# Altium project Sumo_2016.PrjPcb (part 1 of 2)
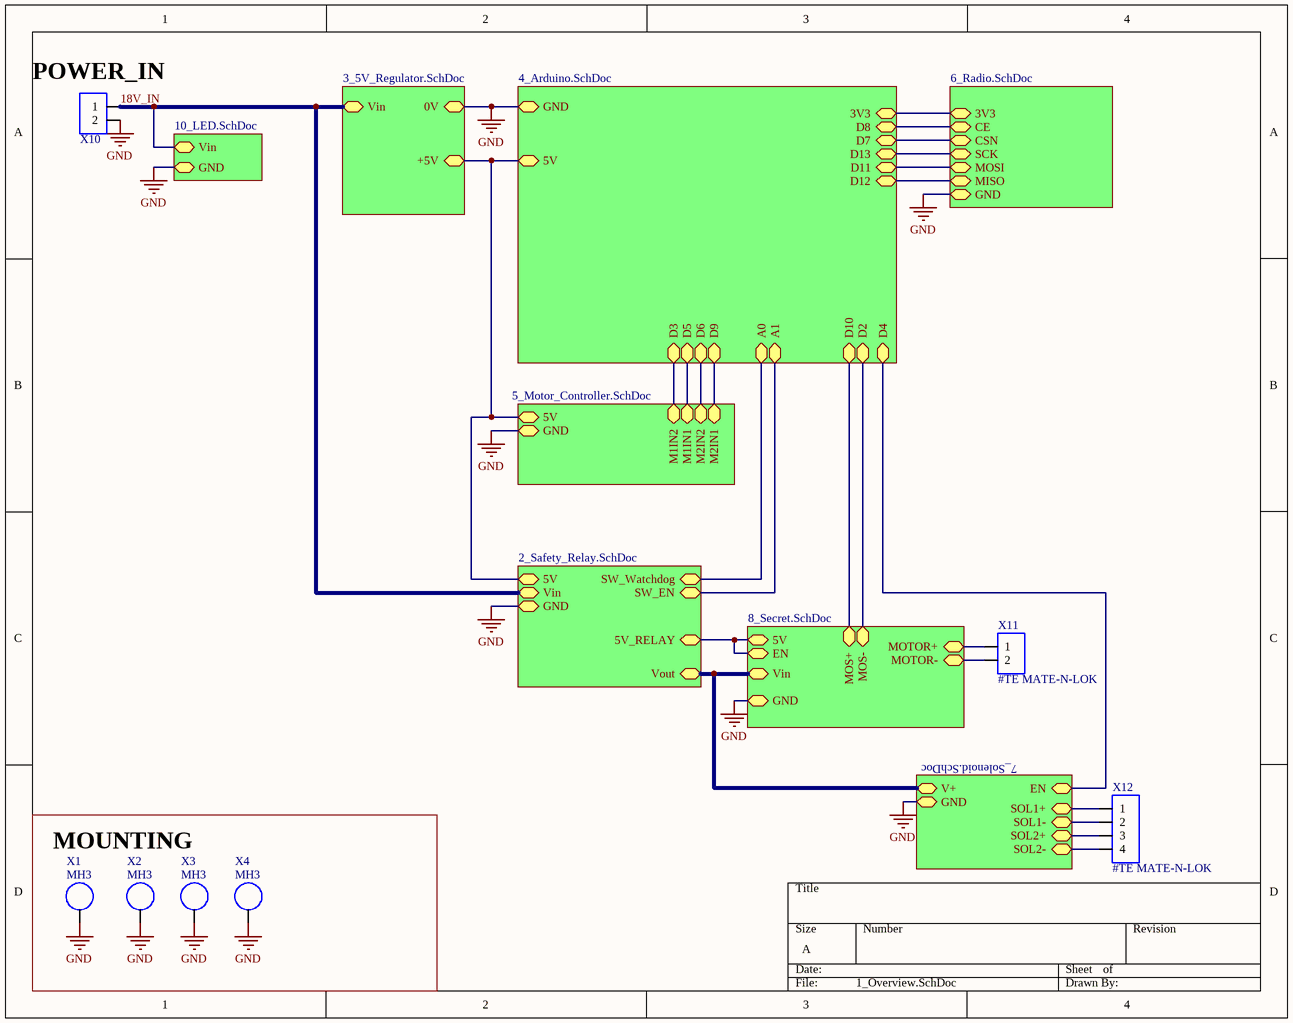
[diagram p0: 1_Overview.SchDoc]
10 sheets, 85 parts. Net scope: strictly hierarchical (ports join the sheet entries above them; power ports are local).
Board file: PCB1.PcbDoc
Sheets:
  1_Overview.SchDoc
     = 3_5V_Regulator.SchDoc
     = 4_Arduino.SchDoc
     = 6_Radio.SchDoc
     = 5_Motor_Controller.SchDoc
     = 2_Safety_Relay.SchDoc
      5 = 10_LED.SchDoc
      1 = 10_LED.SchDoc
      2 = 10_LED.SchDoc
      3 = 10_LED.SchDoc
      4 = 10_LED.SchDoc
       = 11_Watchdog.SchDoc
     = 7_Solenoid.SchDoc
     = 8_Secret.SchDoc
     = 10_LED.SchDoc

## Sheet 1_Overview.SchDoc
size A

### Parts
X1  MH3  [MH-M3-SEMS-6.7-3.6-Vias-Unplated]  (no BOM)
X2  MH3  [MH-M3-SEMS-6.7-3.6-Vias-Unplated]  (no BOM)
X3  MH3  [MH-M3-SEMS-6.7-3.6-Vias-Unplated]  (no BOM)
X4  MH3  [MH-M3-SEMS-6.7-3.6-Vias-Unplated]  (no BOM)
X10  CONN2_12AWG_Hole  [2_Wire_12AWG]  (value not drawn)  (no BOM)
X11  #TE MATE-N-LOK  [HDR-6.35-2-MATENLOK]  (no BOM)
X12  #TE MATE-N-LOK  [HDR-3.0-4X1-MICROMATENLOK-VERT]  (no BOM)

### Blocks framed on the sheet
MOUNTING: X1-X4

### Sub-sheets
? = 3_5V_Regulator.SchDoc: Vin, 0V, +5V
? = 4_Arduino.SchDoc: 5V, GND, D3, D5, D6, D9, 3V3, D8, D7, D13, D11, D12, D10, D4, A0, A1, D2
? = 6_Radio.SchDoc: GND, 3V3, CE, CSN, SCK, MOSI, MISO
? = 5_Motor_Controller.SchDoc: M1IN1, M1IN2, M2IN1, M2IN2, 5V, GND
? = 2_Safety_Relay.SchDoc: Vin, GND, Vout, SW_Watchdog, SW_EN, 5V_RELAY, 5V
? = 7_Solenoid.SchDoc: EN, V+, GND, SOL1+, SOL1-, SOL2+, SOL2-
? = 8_Secret.SchDoc: MOTOR-, EN, Vin, GND, 5V, MOTOR+, MOS+, MOS-
? = 10_LED.SchDoc: GND, Vin

### Nets
5V: sheet /+5V, sheet /5V, sheet /5V, sheet /5V
18V_IN: X10.1 ; sheet /Vin, sheet /Vin, sheet /Vin
EN: sheet /5V_RELAY, sheet /EN, sheet /5V
GND: X1.1 X2.1 X3.1 X4.1 X10.2 ; sheet /0V, sheet /GND, sheet /GND, sheet /GND, sheet /GND, sheet /GND, sheet /GND, sheet /GND
V+: sheet /Vout, sheet /V+, sheet /Vin
EN: sheet /D4, sheet /EN  [a separate net that carries the same name]
MOS+: sheet /D10, sheet /MOS+
MOS-: sheet /D2, sheet /MOS-
NetC82_2: X11.1 ; sheet /MOTOR+
NetC83_2: X11.2 ; sheet /MOTOR-
NetH60_2: sheet /3V3, sheet /3V3
NetH60_3: sheet /D8, sheet /CE
NetH60_4: sheet /D7, sheet /CSN
NetH60_5: sheet /D13, sheet /SCK
NetH60_6: sheet /D11, sheet /MOSI
NetH60_7: sheet /D12, sheet /MISO
NetR72_2: X12.2 ; sheet /SOL1-
NetR76_2: X12.4 ; sheet /SOL2-
NetV21_z: sheet /A1, sheet /SW_EN
NetV71_x: X12.1 ; sheet /SOL1+
NetV74_x: X12.3 ; sheet /SOL2+
NetV200_4: sheet /A0, sheet /SW_Watchdog
NetX42_4: sheet /D9, sheet /M2IN1
NetX42_7: sheet /D6, sheet /M2IN2
NetX42_8: sheet /D5, sheet /M1IN1
NetX42_10: sheet /D3, sheet /M1IN2

### Notes on the sheet
- (near X10) POWER_IN

### Library data of the parts
X1-X4 = 7545: MOUNTING HOLE; Part Field 1: MH3 Loose Unplated with Vias; IPN: 7545; Lead_Process_Compatible: Yes; SubmittedBy: zad; DeviceRank: 2; Part Field 2: - -; ComponentLink1Description: -; ComponentLink2Description: Compliant; ComponentLink1URL: -; ComponentLink2URL: -; Altium_Comment_Old: MH3 Loose Unplated with Vias; Altium_Comment: MH3; Symbol: MOUNTING-HOLE; Manufacturer: -; PartNumber: -; LastChanged: 24/06/14 18:13:23; IPN_Search: 7545; OrderNumber: -; PartType: PCB; CheckedBy: vhq
X10 = -: Symbol: CONN2; Lead_Process_Compatible: Yes; SubmittedBy: ZMZE; DeviceRank: 2; IPN: -; Part Field 1: CONN2_12AWG_Hole; Part Field 2: -; Altium_Comment_Old: CONN2_12AWG_Hole; Altium_Comment: CONN2_12AWG_Hole; Manufacturer: -; PartNumber: -; LastChanged: 27/09/12 10:20:42; Supplier1: -; Supplier1_PartNumber: -; Supplier2: -; Supplier2_PartNumber: -; IPN_Search: -; Characteristics: -; OrderNumber: -; PartType: PCB; Price: -; CheckedBy: -; Price_100: -; Price_1000: -; Price_5000: -
X11 = 5732: Connector 2 pin general; Part Field 1: CONN2 2x1 6.35mm MATE-N-LOK Pin Header Shrouded Vert RoHS; Manufacturer: TYCO; PartNumber: 350786-1; IPN: 5732; EndOfLife: Active EOL:May 2023; Characteristics: TIN Imax10AWG = 19A Vmax = 600V -55..+105; Lead_Process_Compatible: Yes; SubmittedBy: BWJ; DeviceRank: 2; Part Field 2: TYCO 350786-1; ComponentLink1Description: ENG_CD_350786_R2.pdf; ComponentLink2Description: Tyco_350786_MD.pdf; ComponentLink1URL: http://ecad.vsl.com.au/apps/BomGen/Data/rel/datasheets/new_parts/ENG_CD_350786_R2.pdf; ComponentLink2URL: http://ecad.vsl.com.au/apps/BomGen/Data/rel/rohs_compliance/new_certificates/Tyco_350786_MD.pdf; Altium_Comment_Old: CONN2 2x1 6.35mm MATE-N-LOK Pin Header Shrouded Vert RoHS; Altium_Comment: #TE MATE-N-LOK; Symbol: CONN2; LastChanged: 24/02/12 18:41:43; Supplier1: Farnell; Supplier1_PartNumber: 750232; Supplier2: Digikey; Supplier2_PartNumber: A14314-ND; IPN_Search: 5732; OrderNumber: 350786-1; PartType: PCB; Price: 0.76; CheckedBy: LGG; Price_100: M$0.502; Price_1000: M$0.327; Price_5000: M$0.327
X12 = 5975: Connector 4 pin general; Part Field 1: CONN4 4X1 3mm Micro MATE-N-LOK VERT; Manufacturer: TE Connectivity; PartNumber: 2-1445094-4; IPN: 5975; EndOfLife: Active EOL:Jul 2022; Characteristics: Ur=250Vac Imax=5A UL 94V-0 260C 0.30um gold; Lead_Process_Compatible: Yes; SubmittedBy: SAA; DeviceRank: 2; Part Field 2: TE Connectivity 2-1445094-4; ComponentLink1Description: TE Connectivity_2-1445094-4_ENG_CD_1445094_A2.pdf; ComponentLink2Description: TE Connectivity_2-1445094-4_RoHS_Compliance_130325_204622.pdf; ComponentLink1URL: http://ecad.vsl.com.au/apps/BomGen/Data/rel/datasheets/TE Connectivity/TE Connectivity_2-1445094-4_ENG_CD_1445094_A2.pdf; ComponentLink2URL: http://ecad.vsl.com.au/apps/BomGen/Data/rel/rohs_compliance/new_certificates/TE Connectivity_2-1445094-4_RoHS_Compliance_130325_204622.pdf; Altium_Comment_Old: CONN4 4X1 3mm Micro MATE-N-LOK VERT; Altium_Comment: #TE MATE-N-LOK; Symbol: CONN4; LastChanged: 06/05/14 13:09:13; Supplier1: mouser; Supplier1_PartNumber: 2-1445094-4; IPN_Search: 5975; OrderNumber: 2-1445094-4; PartType: PCB; Price: 1.06; CheckedBy: vhq; Price_100: M$0.786; Price_1000: M$0.700; Price_5000: M$0.633

## Sheet 3_5V_Regulator.SchDoc
size A
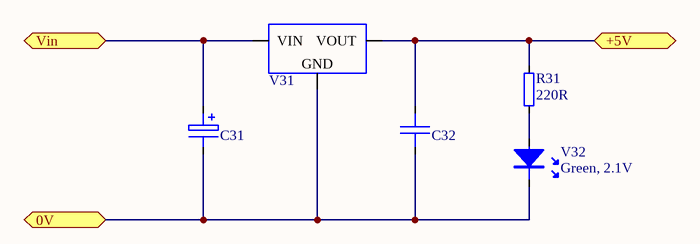
[diagram p1: 3_5V_Regulator.SchDoc]

### Parts
C31  CAP ELEC 100u 63V 20% Radial RoHS  [RBP-3.5-0.8-8.0]  (value not drawn)
C32  10u 50V  [1210]  (value not drawn)
R31  220R  [1206]
V31  LM78L05ACZ  [TO92_W]  (value not drawn)
V32  Green, 2.1V  [LED-0805]

### Ports
0V, +5V, Vin

### Nets
5V: C32.1 R31.1 V31.x(VOUT) ; port +5V
18V_IN: C31.+ V31.z(VIN) ; port Vin
GND: C31.- C32.2 V31.y(GND) V32.k ; port 0V
NetR31_2: R31.2 V32.a

### Library data of the parts
C31 = 5900: Capacitor Polarised; Manufacturer: Panasonic; PartNumber: ECA1JM101; IPN: 5900; EndOfLife: Active EOL:Jul 2022; Characteristics: Ir=270mA tan=0.11 D=8 H=11.5 2000h; Lead_Process_Compatible: Yes; SubmittedBy: GXA; DeviceRank: 2; Part Field 1: CAP ELEC 100u 63V 20% Radial RoHS; Part Field 2: Panasonic ECA1JM101; ComponentLink1Description: Panasonic_ECA-1JM101_DS.pdf; ComponentLink2Description: Panasonic_ECA-1JM101_RCC.pdf; ComponentLink1URL: http://ecad.vsl.com.au/apps/BomGen/Data/rel/datasheets/new_parts/Panasonic_ECA-1JM101_DS.pdf; ComponentLink2URL: http://ecad.vsl.com.au/apps/BomGen/Data/rel/rohs_compliance/new_certificates/Panasonic_ECA-1JM101_RCC.pdf; Altium_Comment_Old: CAP ELEC 100u 63V 20% Radial RoHS; Altium_Comment: CAP ELEC 100u 63V 20% Radial RoHS; Symbol: CAP-POL; LastChanged: 9/11/12 09:27:10; Supplier1: Arrow; Supplier1_PartNumber: ECA1JM101; Supplier2: Digikey; Supplier2_PartNumber: P5193-ND; IPN_Search: 5900; OrderNumber: ECA1JM101; PartType: PCB; Price: US $0.1644; CheckedBy: VHQ; Price_100: M$0.123; Price_1000: M$0.104; Price_5000: M$0.093
C32 = 6024: Capacitor; Part Field 1: CAP CER 10u 10% 50V X7S 1210; Manufacturer: TDK; PartNumber: C3225X7S1H106K250AB; IPN: 6024; EndOfLife: Active EOL:Sep 2023; Characteristics: -55...125C; Lead_Process_Compatible: Yes; SubmittedBy: AFF; DeviceRank: 2; Part Field 2: TDK C3225X7S1H106K250AB; ComponentLink1Description: mlcc_commercial_general_en.pdf; ComponentLink2Description: TDK_C_Series_Capacitors_RoHS_CoC.pdf; ComponentLink1URL: http://ecad.vsl.com.au/apps/BomGen/Data/rel/datasheets/new_parts/mlcc_commercial_general_en.pdf; ComponentLink2URL: \\michelangelo\erg shared folder\ECAD\elecCAD\apps\BomGen\Data\rel\rohs_compliance\new_certificates\TDK_C_Series_Capacitors_RoHS_CoC.pdf; Altium_Comment_Old: CAP CER 10u 10% 50V X7S 1210; Altium_Comment: 10u 50V; Symbol: CAP; LastChanged: 26/02/14 13:10:58; Supplier1: Digikey; Supplier1_PartNumber: 445-4536-2-ND; IPN_Search: 6024; OrderNumber: C3225X7S1H106K250AB; PartType: PCB; Price: $0.31; CheckedBy: TTX; Price_100: M$0.495; Price_1000: M$0.339; Price_5000: M$0.292
R31 = 3827: Resistor; Part Field 1: RES 220R 1% 250mW 1206 RoHS; Manufacturer: Phycomp; PartNumber: RC1206FR-07220RL; IPN: 3827; EndOfLife: Active EOL:Jan 2023; Characteristics: 100ppm/C -55..+155C U=150Vrms Reel=5000pcs; OrderNumber: 232272462201L; Lead_Process_Compatible: Yes; SubmittedBy: ART; DeviceRank: 2; Part Field 2: Phycomp RC1206FR-07220RL; ComponentLink1Description: Phycomp_RC1206series_DS.pdf; ComponentLink2Description: Phycomp_Generic_RCS.pdf; ComponentLink1URL: http://ecad.vsl.com.au/apps/BomGen/Data/rel/datasheets/new_parts/Phycomp_RC1206series_DS.pdf; ComponentLink2URL: http://ecad.vsl.com.au/apps/BomGen/Data/rel/rohs_compliance/new_certificates/Phycomp_Generic_RCS.pdf; Altium_Comment_Old: RES 220R 1% 250mW 1206 RoHS; Altium_Comment: 220R; Symbol: RES; Supplier1: Arrow; Supplier1_PartNumber: RC1206FR-07220RL; Supplier2: Xon; IPN_Search: 3827; PartType: PCB; CheckedBy: ART; Price_5000: M$0.004
V31 = 7713: IC LM78LXX 3-terminal regulator TO92; Part Field 1: IC REG 78L05 +5V 100mA; Manufacturer: TI; PartNumber: LM78L05ACZ/NOPB; IPN: 7713; EndOfLife: Active EOL:Mar 2026; Characteristics: 0..+125C; Lead_Process_Compatible: Yes; SubmittedBy: vhq; DeviceRank: 2; Part Field 2: TI LM78L05ACZ/NOPB; ComponentLink1Description: TI_LM78L05ACZ_NOPB_TI_LM78Lxx.pdf; ComponentLink2Description: TI_LM78L05ACZ_NOPB_TI_LM78Lxx_RoHS.pdf; ComponentLink1URL: http://ecad.vsl.com.au/apps/BomGen/Data/rel/datasheets/TI/TI_LM78L05ACZ_NOPB_TI_LM78Lxx.pdf; ComponentLink2URL: http://ecad.vsl.com.au/apps/BomGen/Data/rel/rohs_compliance/new_certificates/TI_LM78L05ACZ_NOPB_TI_LM78Lxx_RoHS.pdf; Altium_Comment_Old: IC REG 78L05 +5V 100mA; Altium_Comment: LM78L05ACZ; Symbol: LM78LXX-TO92; LastChanged: 24/06/14 09:31:18; Supplier1: Digikey; Supplier1_PartNumber: LM78L05ACZNS/NOPB-ND; IPN_Search: 7713; OrderNumber: LM78L05ACZ/NOPB; PartType: PCB; CheckedBy: pfu
V32 = 6313: LED; Part Field 1: LED GREEN 0805 ROHS; Manufacturer: Chicago Miniature Lighting; PartNumber: CMD17-21UGC/TR8; IPN: 6313; EndOfLife: Active EOL:Sep 2021; Characteristics: GREEN Intensity=15mcd Ta=-40..+85C; Lead_Process_Compatible: Yes; SubmittedBy: ZJXL; DeviceRank: 2; Part Field 2: Chicago Miniature Lighting CMD17-21UGC/TR8; ComponentLink1Description: 1-25.pdf; ComponentLink2Description: CMD17-21UGC_TR8 RoHS CoC.pdf; ComponentLink1URL: \\michelangelo\erg shared folder\ECAD\elecCAD\apps\BomGen\Data\rel\datasheets\new_parts\1-25.pdf; ComponentLink2URL: \\michelangelo\erg shared folder\ECAD\elecCAD\apps\BomGen\Data\rel\rohs_compliance\new_certificates\CMD17-21UGC_TR8 RoHS CoC.pdf; Altium_Comment_Old: LED GREEN 0805 ROHS; Altium_Comment: LED Green; Symbol: LED; LastChanged: 6/09/13 17:30:23; Supplier1: Mouser; Supplier1_PartNumber: 606-CMD17-21UGC; Supplier2: DIGIKEY; Supplier2_PartNumber: L62415CT-ND; IPN_Search: 6313; OrderNumber: CMD17-21UGC/TR8; PartType: PCB; Price: 0.279 USD; CheckedBy: SAA; Price_100: M$0.170; Price_1000: M$0.150; Price_5000: M$0.150

## Sheet 4_Arduino.SchDoc
size A
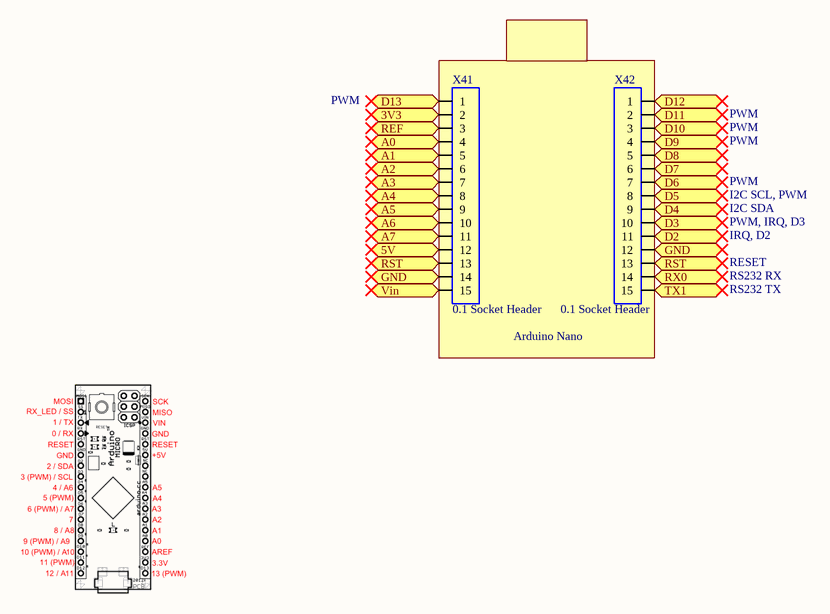
[diagram p2: 4_Arduino.SchDoc]

### Parts
X41  0.1 Socket Header  [HDR-0.1-15X1]
X42  0.1 Socket Header  [HDR-0.1-15X1]

### Blocks framed on the sheet
Arduino Nano: X41 X42

### Ports
3V3, 5V, A0, A1, A2, A3, A4, A5, A6, A7, D2, D3, D4, D5, D6, D7, D8, D9, D10, D11, D12, D13, GND, REF, RST, RX0, TX1, Vin

### Nets
5V: X41.12 ; port 5V
GND: X41.14 X42.12 ; port GND
EN: X42.9 ; port D4
MOS+: X42.3 ; port D10
MOS-: X42.11 ; port D2
NetH60_2: X41.2 ; port 3V3
NetH60_3: X42.5 ; port D8
NetH60_4: X42.6 ; port D7
NetH60_5: X41.1 ; port D13
NetH60_6: X42.2 ; port D11
NetH60_7: X42.1 ; port D12
NetV21_z: X41.5 ; port A1
NetV200_4: X41.4 ; port A0
NetX41_3: X41.3 ; port REF
NetX41_6: X41.6 ; port A2
NetX41_7: X41.7 ; port A3
NetX41_8: X41.8 ; port A4
NetX41_9: X41.9 ; port A5
NetX41_10: X41.10 ; port A6
NetX41_11: X41.11 ; port A7
NetX41_13: X41.13 X42.13 ; port RST
NetX41_15: X41.15 ; port Vin
NetX42_4: X42.4 ; port D9
NetX42_7: X42.7 ; port D6
NetX42_8: X42.8 ; port D5
NetX42_10: X42.10 ; port D3
NetX42_14: X42.14 ; port RX0
NetX42_15: X42.15 ; port TX1

### Notes on the sheet
- PWM
- I2C SCL, PWM
- RS232 RX
- RESET
- IRQ, D2
- PWM, IRQ, D3
- I2C SDA
- RS232 TX

### Library data of the parts
X41 X42 = 9896: Connector 15 pin general; Part Field 1: CONN15 15X1 2.54mm Socket Header, Tin, RoHS; Manufacturer: Sullins; PartNumber: PPTC151LFBN-RC; IPN: 9896; Characteristics: I=3A -40..105C 250V; Lead_Process_Compatible: Yes; SubmittedBy: zmze; DeviceRank: 2; Part Field 2: Sullins PPTC151LFBN-RC; ComponentLink1Description: Sullins_PPTC151LFBN-RC_78_P(N)PxCxxxLFBN-RC,_10492-H.pdf; ComponentLink2Description: Compliant; ComponentLink1URL: http://ecad.vsl.com.au/apps/BomGen/Data/rel/datasheets/Sullins/Sullins_PPTC151LFBN-RC_78_P(N)PxCxxxLFBN-RC,_10492-H.pdf; Altium_Comment_Old: CONN15 15X1 2.54mm Socket Header, Tin, RoHS; Altium_Comment: 0.1 Socket Header; Symbol: CONN15; LastChanged: 09/08/16 08:13:32; Supplier1: Digikey; Supplier1_PartNumber: S7013-ND; IPN_Search: 9896; OrderNumber: PPTC151LFBN-RC; PartType: PCB

## Sheet 6_Radio.SchDoc
size A
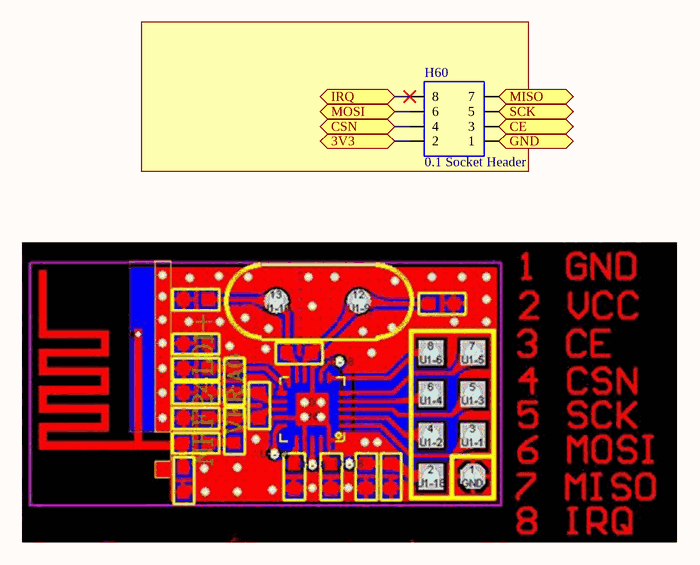
[diagram p3: 6_Radio.SchDoc]

### Parts
H60  0.1 Socket Header  [HDR-0.1-4x2]

### Ports
3V3, CE, CSN, GND, IRQ, MISO, MOSI, SCK

### Nets
GND: H60.1 ; port GND
NetH60_2: H60.2 ; port 3V3
NetH60_3: H60.3 ; port CE
NetH60_4: H60.4 ; port CSN
NetH60_5: H60.5 ; port SCK
NetH60_6: H60.6 ; port MOSI
NetH60_7: H60.7 ; port MISO
NetH60_8: H60.8 ; port IRQ

### Library data of the parts
H60 = 9897: Connector 4x2 way; Part Field 1: CONN8 15X1 2.54mm Socket Header, Gold, RoHS; Manufacturer: Sullins; PartNumber: PPPC042LFBN-RC; IPN: 9897; Characteristics: I=3A -40..105C 250V; Lead_Process_Compatible: Yes; SubmittedBy: zmze; DeviceRank: 2; Part Field 2: Sullins PPPC042LFBN-RC; ComponentLink1Description: Sullins_PPPC042LFBN-RC_Sullins_PPTC151LFBN-RC_78_P(N)PxCxxxLFBN-RC,_10492-H.pdf; ComponentLink2Description: Compliant; ComponentLink1URL: http://ecad.vsl.com.au/apps/BomGen/Data/rel/datasheets/Sullins/Sullins_PPPC042LFBN-RC_Sullins_PPTC151LFBN-RC_78_P(N)PxCxxxLFBN-RC,_10492-H.pdf; Altium_Comment_Old: CONN8 15X1 2.54mm Socket Header, Gold, RoHS; Altium_Comment: 0.1 Socket Header; Symbol: CONN8-4X2; LastChanged: 09/08/16 09:50:21; Supplier1: Digikey; Supplier1_PartNumber: S7107-ND; IPN_Search: 9897; OrderNumber: PPPC042LFBN-RC; PartType: PCB

## Sheet 5_Motor_Controller.SchDoc
size A
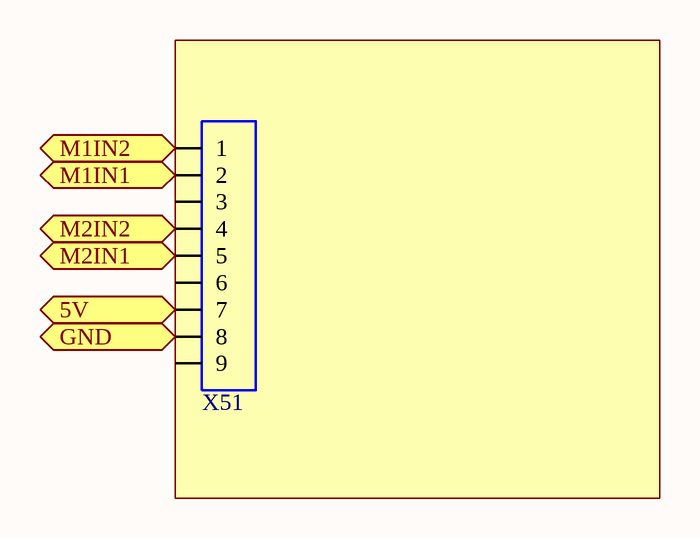
[diagram p4: 5_Motor_Controller.SchDoc]

### Parts
X51  TE 87220-9  [HDR-0.1-9]  (value not drawn)

### Ports
5V, GND, M1IN1, M1IN2, M2IN1, M2IN2

### Nets
5V: X51.7 ; port 5V
GND: X51.8 ; port GND
NetX42_4: X51.5 ; port M2IN1
NetX42_7: X51.4 ; port M2IN2
NetX42_8: X51.2 ; port M1IN1
NetX42_10: X51.1 ; port M1IN2

Not connected (* = marked no-connect by the designer): X51 3 6 9

### Library data of the parts
X51 = 7236: Connector 9 pin general; Part Field 1: CONN9 9X1 2.54mm VERT PIN HEADER; Manufacturer: TE Connectivity; IPN: 7236; EndOfLife: Active EOL:Jul 2022; Characteristics: 0.78um GOLD; Lead_Process_Compatible: Yes; SubmittedBy: ZAD; DeviceRank: 2; Part Field 2: TE Connectivity 87220-9; ComponentLink1Description: TE_87220_Series_DS.pdf; ComponentLink2Description: TE_87220-9_RoHS.pdf; ComponentLink1URL: \\michelangelo\erg shared folder\ECAD\elecCAD\apps\BomGen\Data\rel\datasheets\new_parts\TE_87220_Series_DS.pdf; ComponentLink2URL: \\michelangelo\erg shared folder\ECAD\elecCAD\apps\BomGen\Data\rel\rohs_compliance\new_certificates\TE_87220-9_RoHS.pdf; Altium_Comment_Old: CONN9 9X1 2.54mm VERT PIN HEADER; Altium_Comment: TE 87220-9; Symbol: CONN9; PartNumber: 87220-9; LastChanged: 11/12/13 08:07:33; Supplier1: Mouser; Supplier1_PartNumber: 571-87220-9; IPN_Search: 7236; PartType: PCB; Price: 3.60 USD; CheckedBy: PFU; Price_100: M$2.970; Price_1000: M$2.700; Price_5000: M$2.700

## Sheet 2_Safety_Relay.SchDoc
size A
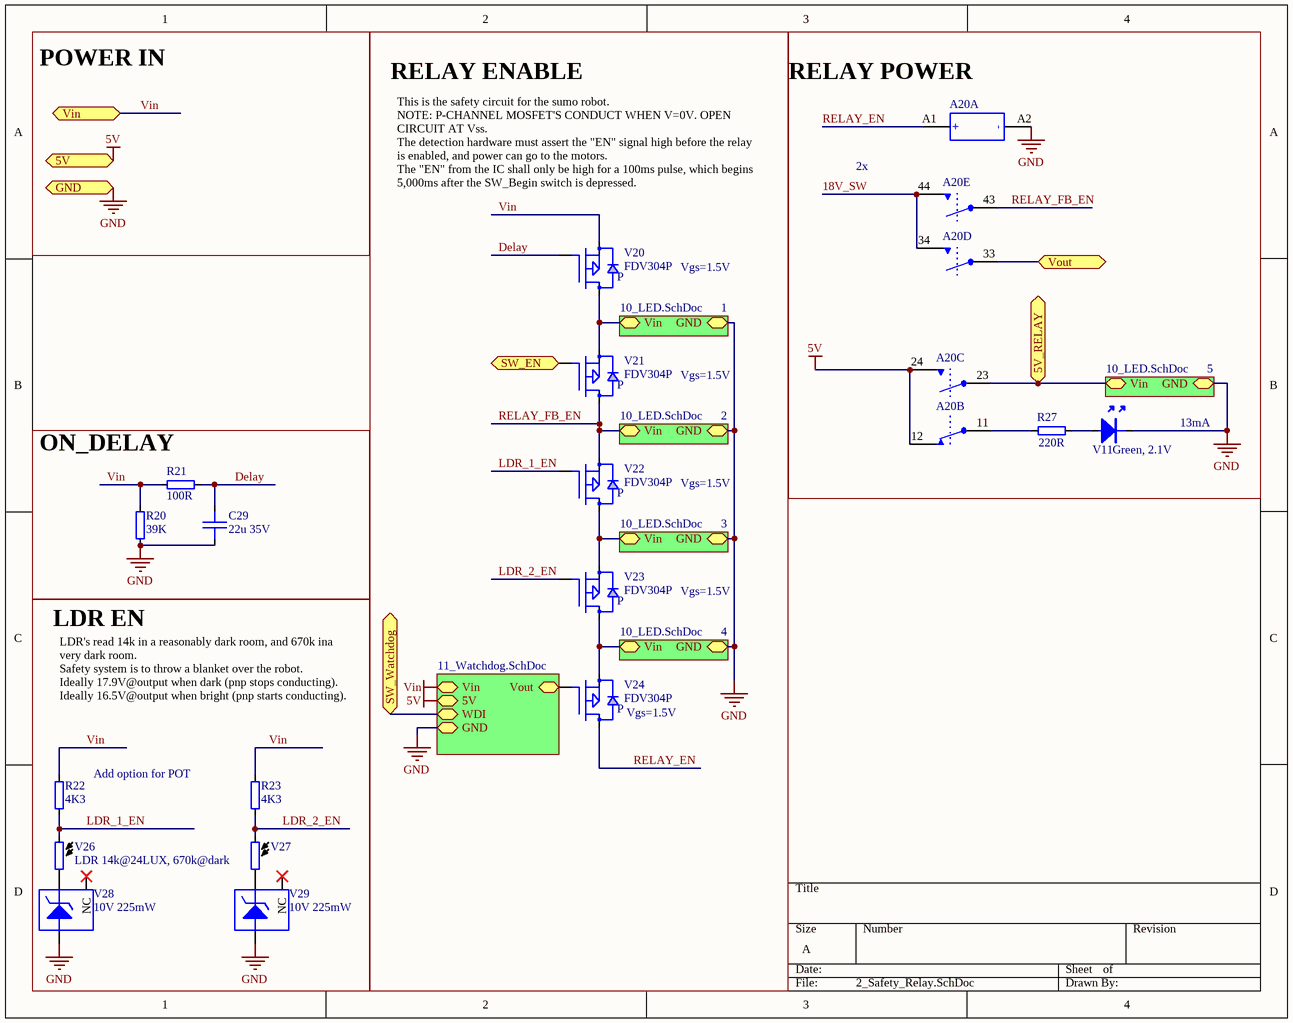
[diagram p5: 2_Safety_Relay.SchDoc]

### Parts
A20  RELAY SAFETY 4PST 8A 18V  [RELAY-BRUMFIELD-4PST-3NO-1NC]  (value not drawn)  (parts A,B,C,D,E of 5)
C29  22u 35V  [0805]
R20  39K  [0805]
R21  100R  [0805]
R22  4K3  [0603]
R23  4K3  [0603]
R27  220R  [1206]
V11  Green, 2.1V  [LED-0805]
V20  FDV304P  [SOT23]
V21  FDV304P  [SOT23]
V22  FDV304P  [SOT23]
V23  FDV304P  [SOT23]
V24  FDV304P  [SOT23]
V26  LDR 14k@24LUX, 670k@dark  [LDR_NSL-5112]
V27  LDR 14k@24LUX, 670k@dark  [LDR_NSL-5112]  (value not drawn)
V28  10V 225mW  [SOT23]
V29  10V 225mW  [SOT23]

### Blocks framed on the sheet
RELAY ENABLE: V20-V24
RELAY POWER: A20 R27 V11
ON_DELAY: C29 R20 R21
LDR EN: R22 R23 V26-V29

### Sub-sheets
1 = 10_LED.SchDoc: Vin, GND
2 = 10_LED.SchDoc: Vin, GND
3 = 10_LED.SchDoc: Vin, GND
4 = 10_LED.SchDoc: Vin, GND
5 = 10_LED.SchDoc: Vin, GND
? = 11_Watchdog.SchDoc: Vin, 5V, WDI, GND, Vout

### Ports
5V, 5V_RELAY, GND, SW_EN, SW_Watchdog, Vin, Vout

### Nets
5V: A20.12 A20.24 ; port 5V, sheet /5V
EN: A20.23 ; port 5V_RELAY, sheet 5/Vin
GND: A20.A2 C29.2 R20.1 V11.k V28.z(a) V29.z(a) ; port GND, sheet 5/GND, sheet 1/GND, sheet 2/GND, sheet 3/GND, sheet 4/GND, sheet /GND
V+: A20.33 ; port Vout
Vin: R20.2 R21.1 R22.2 R23.2 V20.y(s) ; port Vin, sheet /Vin  [project net 18V_IN]
18V_SW: A20.34 A20.44
Delay: C29.1 R21.2 V20.z(gate)
LDR_1_EN: R22.1 V22.z(gate) V26.1
LDR_2_EN: R23.1 V23.z(gate) V27.1
RELAY_EN: A20.A1 V24.x(d)
RELAY_FB_EN: A20.43 V21.x(d) V22.y(s) ; sheet 2/Vin
NetA20_11: A20.11 R27.1
NetR4_1: V24.z(gate) ; sheet /Vout
NetR27_2: R27.2 V11.a
NetV20_x: V20.x(d) V21.y(s) ; sheet 1/Vin
NetV21_z: V21.z(gate) ; port SW_EN
NetV22_x: V22.x(d) V23.y(s) ; sheet 3/Vin
NetV23_x: V23.x(d) V24.y(s) ; sheet 4/Vin
NetV26_2: V26.2 V28.x(k)
NetV27_2: V27.2 V29.x(k)
NetV200_4: port SW_Watchdog, sheet /WDI

Not connected (* = marked no-connect by the designer): V28 y(NC)*; V29 y(NC)*

### Notes on the sheet
- POWER IN
- This is the safety circuit for the sumo robot.
  NOTE: P-CHANNEL MOSFET'S CONDUCT WHEN V=0V. OPEN CIRCUIT AT Vss.
  The detection hardware must assert the "EN" signal high before the relay is enabled, and power can go to the motors.
  The "EN" from the IC shall only be high for a 100ms pulse, which begins 5,000ms after the SW_Begin switch is depressed.
- 2x
- Vgs=1.5V
- 13mA
- LDR's read 14k in a reasonably dark room, and 670k ina  very dark room.
  Safety system is to throw a blanket over the robot.
  Ideally 17.9V@output when dark (pnp stops conducting).
  Ideally 16.5V@output when bright (pnp starts conducting).
- Add option for POT
- (near V24) Vgs=1.5V
- (in symbol 5221) P
- (in symbol 9827, part A) -; +

### Library data of the parts
A20 = 9827: Safety Relay 4PST, 3NO 1 NC; Manufacturer: TE Connectivity Potter & Brumfield Relays; PartNumber: SR4M4018; IPN: 9827; Characteristics: 18VDC 405ohm  1250VAC/8A-Switching-load; Lead_Process_Compatible: Yes; SubmittedBy: zmze; DeviceRank: 2; Part Field 1: RELAY SAFETY 4PST 8A 18V; Part Field 2: TE Connectivity Potter & Brumfield Relays SR4M4018; ComponentLink2Description: Compliant; Altium_Comment_Old: RELAY SAFETY 4PST 8A 18V; Altium_Comment: RELAY SAFETY 4PST 8A 18V; Symbol: RELAY-4PST-3A1B; LastChanged: 27/05/16 08:10:39; Supplier1: Digikey; Supplier1_PartNumber: PB1304-ND; IPN_Search: 9827; OrderNumber: SR4M4018; PartType: PCB; ComponentLink1Description: TE Connectivity Potter & Brumfield Relays_SR4M4018_ENG_DS_SR4_DXM_0415.pdf; ComponentLink1URL: http://ecad.vsl.com.au/apps/BomGen/Data/rel/datasheets/TE Connectivity Potter & Brumfield Relays/TE Connectivity Potter & Brumfield Relays_SR4M4018_ENG_DS_SR4_DXM_0415.pdf
C29 = 8018: Capacitor; Part Field 1: CAP CER 22u 20% 35V X5R 0805 RoHS; Manufacturer: TDK; PartNumber: C2012X5R1V226M125AC; IPN: 8018; EndOfLife: Active EOL:Jul 2028; Characteristics: -55..85C; Lead_Process_Compatible: Yes; SubmittedBy: ptk; DeviceRank: 2; Part Field 2: TDK C2012X5R1V226M125AC; ComponentLink1Description: TDK_C2012X5R1V226M125AC_TDK multilayer ceramic caps.pdf; ComponentLink2Description: TDK_C2012X5R1V226M125AC_C2012X5R1V226M125AC.pdf; ComponentLink1URL: http://ecad.vsl.com.au/apps/BomGen/Data/rel/datasheets/TDK/TDK_C2012X5R1V226M125AC_TDK multilayer ceramic caps.pdf; ComponentLink2URL: http://ecad.vsl.com.au/apps/BomGen/Data/rel/rohs_compliance/new_certificates/TDK_C2012X5R1V226M125AC_C2012X5R1V226M125AC.pdf; Altium_Comment_Old: CAP CER 22u 20% 35V X5R 0805 RoHS; Altium_Comment: 22u 35V; Symbol: CAP; LastChanged: 20/08/15 08:08:22; Supplier1: DigiKey; Supplier1_PartNumber: 445-14428-1-ND; IPN_Search: 8018; OrderNumber: C2012X5R1V226M125AC; PartType: PCB; CheckedBy: pfu
R20 = 3712: Resistor; Part Field 1: RES 39K 1% 125mW 0805 RoHS; Manufacturer: Phycomp; PartNumber: RC0805FR-0739KL; IPN: 3712; EndOfLife: Active EOL:Jan 2023; Characteristics: 100ppm/C -55..+155C U=150Vrms Reel=5000pcs; OrderNumber: 232273463903L; Lead_Process_Compatible: Yes; SubmittedBy: ART; DeviceRank: 2; Part Field 2: Phycomp RC0805FR-0739KL; ComponentLink1Description: Phycomp_RC0805series_DS.pdf; ComponentLink2Description: Phycomp_Generic_RCS.pdf; ComponentLink1URL: http://ecad.vsl.com.au/apps/BomGen/Data/rel/datasheets/new_parts/Phycomp_RC0805series_DS.pdf; ComponentLink2URL: http://ecad.vsl.com.au/apps/BomGen/Data/rel/rohs_compliance/new_certificates/Phycomp_Generic_RCS.pdf; Altium_Comment_Old: RES 39K 1% 125mW 0805 RoHS; Altium_Comment: 39K; Symbol: RES; Supplier1: Arrow; Supplier1_PartNumber: RC0805FR-0739KL; Supplier2: Xon; IPN_Search: 3712; PartType: PCB; CheckedBy: ART; Price_5000: M$0.003
R21 = 3650: Resistor; Part Field 1: RES 100R 1% 125mW 0805 RoHS; Manufacturer: Phycomp; PartNumber: RC0805FR-07100RL; IPN: 3650; EndOfLife: Active EOL:Jan 2023; Characteristics: 100ppm/C -55..+155C U=150Vrms Reel=5000pcs; OrderNumber: 232273461001L; Lead_Process_Compatible: Yes; SubmittedBy: ART; DeviceRank: 2; Part Field 2: Phycomp RC0805FR-07100RL; ComponentLink1Description: Phycomp_RC0805series_DS.pdf; ComponentLink2Description: Phycomp_Generic_RCS.pdf; ComponentLink1URL: http://ecad.vsl.com.au/apps/BomGen/Data/rel/datasheets/new_parts/Phycomp_RC0805series_DS.pdf; ComponentLink2URL: http://ecad.vsl.com.au/apps/BomGen/Data/rel/rohs_compliance/new_certificates/Phycomp_Generic_RCS.pdf; Altium_Comment_Old: RES 100R 1% 125mW 0805 RoHS; Altium_Comment: 100R; Symbol: RES; Supplier1: Arrow; Supplier1_PartNumber: RC0805FR-07100RL; Supplier2: Xon; IPN_Search: 3650; PartType: PCB; CheckedBy: ART; Price_5000: M$0.003
R22 R23 = 3520: Resistor; Part Field 1: RES 4K3 1% 100mW 0603 RoHS; Manufacturer: Phycomp; PartNumber: RC0603FR-074K3L; IPN: 3520; EndOfLife: Active EOL:Jan 2023; AltIPN1: 6663; AltMFG1: PANASONIC; AltPN1: ERJ3EKF4301V; Characteristics: 100ppm/C -55..+155C U=50Vrms Reel=5000pcs; OrderNumber: 232270464302L; Lead_Process_Compatible: Yes; SubmittedBy: ART; DeviceRank: 1; Part Field 2: Phycomp RC0603FR-074K3L; ComponentLink1Description: Phycomp_RC0603series_DS.pdf; ComponentLink2Description: Phycomp_Generic_RCS.pdf; ComponentLink1URL: http://ecad.vsl.com.au/apps/BomGen/Data/rel/datasheets/new_parts/Phycomp_RC0603series_DS.pdf; ComponentLink2URL: http://ecad.vsl.com.au/apps/BomGen/Data/rel/rohs_compliance/new_certificates/Phycomp_Generic_RCS.pdf; Altium_Comment_Old: RES 4K3 1% 100mW 0603 RoHS; Altium_Comment: 4K3; Symbol: RES; LastChanged: 28/11/07 14:44:00; AltDesc1: RES 4K3 1% 100mW 0603 RoHS; AltROHS1: pa003.pdf; AltEOL1: Active EOL:Jan 2023; Supplier1: Arrow; Supplier1_PartNumber: RC0603FR-074K3L; Supplier2: Xon; Supplier2_PartNumber: 232270464302L; IPN_Search: 3520; PartType: PCB; CheckedBy: ART; Price_5000: M$0.002
R27 = 3827: as R31 on sheet 3_5V_Regulator; Part Field 2: Phycomp RC1206FR-07220RL; ComponentLink1Description: Phycomp_RC1206series_DS.pdf; ComponentLink2Description: Phycomp_Generic_RCS.pdf; ComponentLink1URL: http://ecad.vsl.com.au/apps/BomGen/Data/rel/datasheets/new_parts/Phycomp_RC1206series_DS.pdf; ComponentLink2URL: http://ecad.vsl.com.au/apps/BomGen/Data/rel/rohs_compliance/new_certificates/Phycomp_Generic_RCS.pdf; Altium_Comment_Old: RES 220R 1% 250mW 1206 RoHS; Altium_Comment: 220R; Symbol: RES; Supplier1: Arrow; Supplier1_PartNumber: RC1206FR-07220RL; Supplier2: Xon; IPN_Search: 3827; PartType: PCB; CheckedBy: ART; Price_5000: M$0.004
V11 = 6313: as V32 on sheet 3_5V_Regulator; Part Field 2: Chicago Miniature Lighting CMD17-21UGC/TR8; ComponentLink1Description: 1-25.pdf; ComponentLink2Description: CMD17-21UGC_TR8 RoHS CoC.pdf; ComponentLink1URL: \\michelangelo\erg shared folder\ECAD\elecCAD\apps\BomGen\Data\rel\datasheets\new_parts\1-25.pdf; ComponentLink2URL: \\michelangelo\erg shared folder\ECAD\elecCAD\apps\BomGen\Data\rel\rohs_compliance\new_certificates\CMD17-21UGC_TR8 RoHS CoC.pdf; Altium_Comment_Old: LED GREEN 0805 ROHS; Altium_Comment: LED Green; Symbol: LED; LastChanged: 6/09/13 17:30:23; Supplier1: Mouser; Supplier1_PartNumber: 606-CMD17-21UGC; Supplier2: DIGIKEY; Supplier2_PartNumber: L62415CT-ND; IPN_Search: 6313; OrderNumber: CMD17-21UGC/TR8; PartType: PCB; Price: 0.279 USD; CheckedBy: SAA; Price_100: M$0.170; Price_1000: M$0.150; Price_5000: M$0.150
V20-V24 = 5221: MOSFET P CHANNEL GENERIC SOT23; Part Field 1: MOSFET P-CH FDV304P SOT23; Manufacturer: Fairchild; IPN: 5221; EndOfLife: Active EOL:Jul 2022; Characteristics: 25V 0.46A 1.5R Vgs=1.5V 150deg; Lead_Process_Compatible: Yes; SubmittedBy: KZB; DeviceRank: 2; Part Field 2: Fairchild FDV304P; ComponentLink1Description: Fairchild_FDV304P_DS.pdf; ComponentLink2Description: Fairchild_Generic_RCS.pdf; ComponentLink1URL: http://ecad.vsl.com.au/apps/BomGen/Data/rel/datasheets/new_parts/Fairchild_FDV304P_DS.pdf; ComponentLink2URL: http://ecad.vsl.com.au/apps/BomGen/Data/rel/rohs_compliance/new_certificates/Fairchild_Generic_RCS.pdf; Altium_Comment_Old: MOSFET P-CH FDV304P SOT23; Altium_Comment: FDV304P; Symbol: MOSFET-P-SOT23; PartNumber: FDV304P; LastChanged: 10/06/10 13:58:43; Supplier1: Digikey; Supplier1_PartNumber: FDV304PCT-ND; Supplier2: Farnell; Supplier2_PartNumber: 9846123; IPN_Search: 5221; OrderNumber: FDV304P; PartType: PCB; Price: 0.697; CheckedBy: AJR; Price_100: M$0.102; Price_1000: M$0.070; Price_5000: M$0.053
V26 V27 = 9828: LDR; Part Field 1: LDR Photocell, 14k@24LUX, 670k@dark; Manufacturer: Luna Optoelectronics; IPN: 9828; Characteristics: 550nm, 100vPk, -65...+75C, 50mW max,; Lead_Process_Compatible: Yes; SubmittedBy: zmze; DeviceRank: 2; Part Field 2: Luna Optoelectronics NSL-5112; ComponentLink1Description: Luna Optoelectronics_NSL-5112_NSL-5112.pdf; ComponentLink2Description: Non_compliant; ComponentLink1URL: http://ecad.vsl.com.au/apps/BomGen/Data/rel/datasheets/Luna Optoelectronics/Luna Optoelectronics_NSL-5112_NSL-5112.pdf; Altium_Comment_Old: LDR Photocell, 14k@24LUX, 670k@dark; Altium_Comment: LDR 14k@24LUX, 670k@dark; Symbol: LDR; PartNumber: NSL-5112; LastChanged: 27/05/16 08:14:08; Supplier1: Digikey; Supplier1_PartNumber: NSL-5112-ND; IPN_Search: 9828; OrderNumber: NSL-5112; PartType: PCB
V28 V29 = 6327: DIODE ZENER SOT23 a-z k-x nc-y; Part Field 1: DIODE ZENER 10V 5% 225mW SOT23 RoHS; Manufacturer: ON Semi; PartNumber: BZX84C10LT1G; IPN: 6327; Characteristics: Vf=900mV Zzt=20R -65..+150C Reel=3000; Lead_Process_Compatible: Yes; SubmittedBy: VQD; DeviceRank: 2; Part Field 2: ON Semi BZX84C10LT1G; ComponentLink1Description: ON Semi_BZX84C10LT1G_BZX84 Series.pdf; ComponentLink2Description: ON Semi_BZX84C10LT1G_BZX84C10LT1G RoHS Cert.pdf; ComponentLink1URL: http://ecad.vsl.com.au/apps/BomGen/Data/rel/datasheets/ON Semi/ON Semi_BZX84C10LT1G_BZX84 Series.pdf; ComponentLink2URL: http://ecad.vsl.com.au/apps/BomGen/Data/rel/rohs_compliance/new_certificates/ON Semi_BZX84C10LT1G_BZX84C10LT1G RoHS Cert.pdf; Altium_Comment_Old: DIODE ZENER 10V 5% 225mW SOT23 RoHS; Altium_Comment: 10V 225mW; Symbol: ZENER-SOT23; LastChanged: 07/07/14 15:36:02; Supplier1: Digikey; Supplier1_PartNumber: BZX84C10LT1GOSTR-ND; IPN_Search: 6327; OrderNumber: BZX84C10LT1G; PartType: PCB; Price: 0.08990

## Sheet 10_LED.SchDoc
size A4
Used 6 times, as channels /5, /1, /2, /3, /4, . Parts and nets are listed once, with the designators drawn on the sheet.
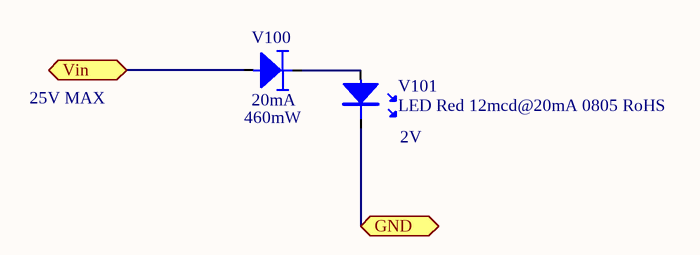
[diagram p6: 10_LED.SchDoc]

### Parts
V100  20mA  [SOD123]
V101  LED Red 12mcd@20mA 0805 RoHS  [LED-0805]

### Ports
GND, Vin

### Nets
GND: V101.k ; port GND
Vin: V100.a ; port Vin
NetV100_k: V100.k V101.a

### Channels
/5: designators end in _5; ports GND=GND Vin=EN
/1: designators end in _1; ports GND=GND Vin=NetV20_x
/2: designators end in _2; ports GND=GND Vin=RELAY_FB_EN
/3: designators end in _3; ports GND=GND Vin=NetV22_x
/4: designators end in _4; ports GND=GND Vin=NetV23_x
(top): designators V100=V100_ V101=V101; ports GND=GND Vin=18V_IN

### Notes on the sheet
- 25V MAX
- (near V100) 460mW
- (near V101) 2V

### Library data of the parts
V100 = 9913: CURRENT REG; Part Field 1: IC CONSTANT CURRENT REG 15MA 460mW; Manufacturer: On Semiconductor; PartNumber: NSI45015WT1G; IPN: 9913; Characteristics: 20MA 45V 460mW RoHS; Lead_Process_Compatible: Yes; SubmittedBy: zmze; DeviceRank: 2; Part Field 2: On Semiconductor NSI45015WT1G; ComponentLink1Description: On Semiconductor_NSI45015WT1G_NSI45015W-D.PDF; ComponentLink2Description: Compliant; ComponentLink1URL: http://ecad.vsl.com.au/apps/BomGen/Data/rel/datasheets/On Semiconductor/On Semiconductor_NSI45015WT1G_NSI45015W-D.PDF; Altium_Comment_Old: IC CONSTANT CURRENT REG 15MA 460mW; Altium_Comment: 20mA; Symbol: AL5809; LastChanged: 12/08/16 11:28:58; Supplier1: DigiKey; Supplier1_PartNumber: NSI45015WT1GOSCT-ND; IPN_Search: 9913; OrderNumber: NSI45015WT1G; PartType: PCB
V101 = 2785: LED; Manufacturer: Kingbright; PartNumber: KP-2012EC; IPN: 2785; EndOfLife: Active EOL:Jun 2020; Characteristics: Wpk=627nm Vftyp=2V Vfmax=2.5V Ifmax=30mA -40..+85 View angle=120deg; Lead_Process_Compatible: Yes; SubmittedBy: LGG; DeviceRank: 2; Part Field 1: LED Red 12mcd@20mA 0805 RoHS; Part Field 2: Kingbright KP-2012EC; ComponentLink1Description: Kingbright_KP-2012EC_DS.pdf; ComponentLink2Description: Kingbright_KPseries_RCS.pdf; ComponentLink1URL: http://ecad.vsl.com.au/apps/BomGen/Data/rel/datasheets/new_parts/Kingbright_KP-2012EC_DS.pdf; ComponentLink2URL: http://ecad.vsl.com.au/apps/BomGen/Data/rel/rohs_compliance/new_certificates/Kingbright_KPseries_RCS.pdf; Altium_Comment_Old: LED Red 12mcd@20mA 0805 RoHS; Altium_Comment: LED Red 12mcd@20mA 0805 RoHS; Symbol: LED; LastChanged: 27/06/08 15:06:33; Supplier1: Tenrod; Supplier1_PartNumber: KP-2012EC; Supplier2: Farnell; Supplier2_PartNumber: 8529949; IPN_Search: 2785; OrderNumber: KP-2012EC; PartType: PCB; Price: 0.08; CheckedBy: ART

## Sheet 11_Watchdog.SchDoc
size A4
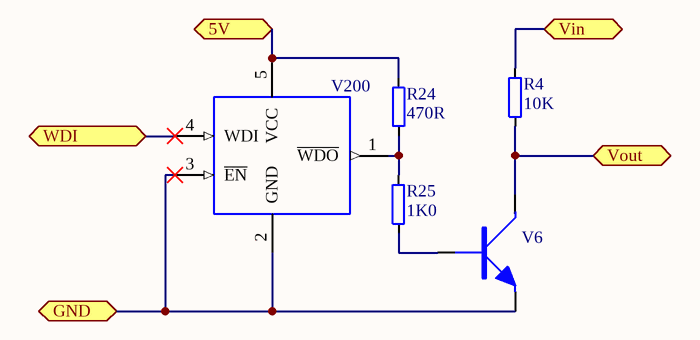
[diagram p7: 11_Watchdog.SchDoc]

### Parts
R4  10K  [1206]
R24  470R  [1206]
R25  1K0  [1206]
V6  BC846B  [SOT23]  (value not drawn)
V200  STWD100NYWY3F  [SOT23-5]  (value not drawn)

### Ports
5V, GND, Vin, Vout, WDI

### Nets
5V: R24.1 V200.5(VCC) ; port 5V
18V_IN: R4.2 ; port Vin
GND: V6.y(Emitter) V200.2(GND) V200.3(~{EN}) ; port GND
NetR4_1: R4.1 V6.x(Collector) ; port Vout
NetR24_2: R24.2 R25.2 V200.1(~{WDO})
NetR25_1: R25.1 V6.z(Base)
NetV200_4: V200.4(WDI) ; port WDI

### Library data of the parts
R4 = 3867: Resistor; Part Field 1: RES 10K 1% 250mW 1206 RoHS; Manufacturer: Phycomp; PartNumber: RC1206FR-0710KL; IPN: 3867; EndOfLife: Active EOL:Jan 2031; Characteristics: 100ppm/C -55..+155C U=150Vrms Reel=5000pcs; OrderNumber: 232272461003L; Lead_Process_Compatible: Yes; SubmittedBy: ART; DeviceRank: 2; Part Field 2: Phycomp RC1206FR-0710KL; ComponentLink1Description: Phycomp_RC1206series_DS.pdf; ComponentLink2Description: Phycomp_Generic_RCS.pdf; ComponentLink1URL: http://ecad.vsl.com.au/apps/BomGen/Data/rel/datasheets/new_parts/Phycomp_RC1206series_DS.pdf; ComponentLink2URL: http://ecad.vsl.com.au/apps/BomGen/Data/rel/rohs_compliance/new_certificates/Phycomp_Generic_RCS.pdf; Altium_Comment_Old: RES 10K 1% 250mW 1206 RoHS; Altium_Comment: 10K; Symbol: RES; Supplier1: Arrow; Supplier1_PartNumber: RC1206FR-0710KL; Supplier2: Xon; IPN_Search: 3867; PartType: PCB; CheckedBy: ART; Price_5000: M$0.004
R24 = 3835: Resistor; Part Field 1: RES 470R 1% 250mW 1206 RoHS; Manufacturer: Phycomp; PartNumber: RC1206FR-07470RL; IPN: 3835; EndOfLife: Active EOL:Jan 2023; Characteristics: 100ppm/C -55..+155C U=150Vrms Reel=5000pcs; OrderNumber: 232272464701L; Lead_Process_Compatible: Yes; SubmittedBy: ART; DeviceRank: 2; Part Field 2: Phycomp RC1206FR-07470RL; ComponentLink1Description: Phycomp_RC1206series_DS.pdf; ComponentLink2Description: Phycomp_Generic_RCS.pdf; ComponentLink1URL: http://ecad.vsl.com.au/apps/BomGen/Data/rel/datasheets/new_parts/Phycomp_RC1206series_DS.pdf; ComponentLink2URL: http://ecad.vsl.com.au/apps/BomGen/Data/rel/rohs_compliance/new_certificates/Phycomp_Generic_RCS.pdf; Altium_Comment_Old: RES 470R 1% 250mW 1206 RoHS; Altium_Comment: 470R; Symbol: RES; Supplier1: Arrow; Supplier1_PartNumber: RC1206FR-07470RL; Supplier2: Xon; IPN_Search: 3835; PartType: PCB; CheckedBy: ART; Price_5000: M$0.004
R25 = 3843: Resistor; Part Field 1: RES 1K0 1% 250mW 1206 RoHS; Manufacturer: Phycomp; PartNumber: RC1206FR-071KL; IPN: 3843; EndOfLife: Active EOL:Jan 2031; Characteristics: 100ppm/C -55..+155C U=150Vrms Reel=5000pcs; OrderNumber: 232272461002L; Lead_Process_Compatible: Yes; SubmittedBy: ART; DeviceRank: 2; Part Field 2: Phycomp RC1206FR-071KL; ComponentLink1Description: Phycomp_RC1206series_DS.pdf; ComponentLink2Description: Phycomp_Generic_RCS.pdf; ComponentLink1URL: http://ecad.vsl.com.au/apps/BomGen/Data/rel/datasheets/new_parts/Phycomp_RC1206series_DS.pdf; ComponentLink2URL: http://ecad.vsl.com.au/apps/BomGen/Data/rel/rohs_compliance/new_certificates/Phycomp_Generic_RCS.pdf; Altium_Comment_Old: RES 1K0 1% 250mW 1206 RoHS; Altium_Comment: 1K0; Symbol: RES; Supplier1: Arrow; Supplier1_PartNumber: RC1206FR-071KL; Supplier2: Xon; IPN_Search: 3843; PartType: PCB; CheckedBy: ART; Price_5000: M$0.004
V6 = 3412: NPN Transistor SOT23; Part Field 1: BJT NPN BC846 SOT23 RoHS; Manufacturer: NXP; IPN: 3412; EndOfLife: Active EOL:Nov 2023; Characteristics: Ic=100mA Vceo=65V Pt=250mW Tj=150degC Hfe=200..450; OrderNumber: 9335 895 60215; Lead_Process_Compatible: Yes; SubmittedBy: ART; DeviceRank: 1; Part Field 2: NXP BC846B; ComponentLink1Description: NXP_BC84xseries_DS.pdf; ComponentLink2Description: NXP_BC846B_MD.xls; ComponentLink1URL: http://ecad.vsl.com.au/apps/BomGen/Data/rel/datasheets/new_parts/NXP_BC84xseries_DS.pdf; ComponentLink2URL: Not Found; Altium_Comment_Old: BJT NPN BC846 SOT23 RoHS; Altium_Comment: BC846B; Symbol: NPN-SOT23; PartNumber: BC846B; LastChanged: 24/08/09 11:56:43; Supplier1: Mouser; Supplier1_PartNumber: 771-BC846B-T/R; Supplier2: Digikey; Supplier2_PartNumber: 568-1632-1-ND; IPN_Search: 3412; PartType: PCB; CheckedBy: LZZ; Price_100: M$0.040; Price_1000: M$0.027; Price_5000: M$0.020
V200 = 5674: IC Watchdog Timer Circuit; Part Field 1: Microprocessor Watchdog Timer STWD100NY; Manufacturer: ST Microelectronics; IPN: 5674; EndOfLife: Active EOL:Dec 2024; Characteristics: Open Drain Output 210ms; Lead_Process_Compatible: Yes; SubmittedBy: GRH; DeviceRank: 2; Part Field 2: ST Microelectronics STWD100NYWY3F; ComponentLink1Description: STWD100.pdf; ComponentLink2Description: ROHSSTWD100NYWY3F.pdf; ComponentLink1URL: http://ecad.vsl.com.au/apps/BomGen/Data/rel/datasheets/new_parts/STWD100.pdf; ComponentLink2URL: http://ecad.vsl.com.au/apps/BomGen/Data/rel/rohs_compliance/new_certificates/ROHSSTWD100NYWY3F.pdf; Altium_Comment_Old: Microprocessor Watchdog Timer STWD100NY; Altium_Comment: STWD100NYWY3F; Symbol: STWD100; PartNumber: STWD100NYWY3F; LastChanged: 20/04/11 08:20:11; Supplier1: Digikey; Supplier1_PartNumber: 497-10058-1-ND; IPN_Search: 5674; PartType: PCB; Price: 1.40 (USD); CheckedBy: SAA; Price_100: M$0.611; Price_1000: M$0.426; Price_5000: M$0.378

## Sheet 7_Solenoid.SchDoc
size A
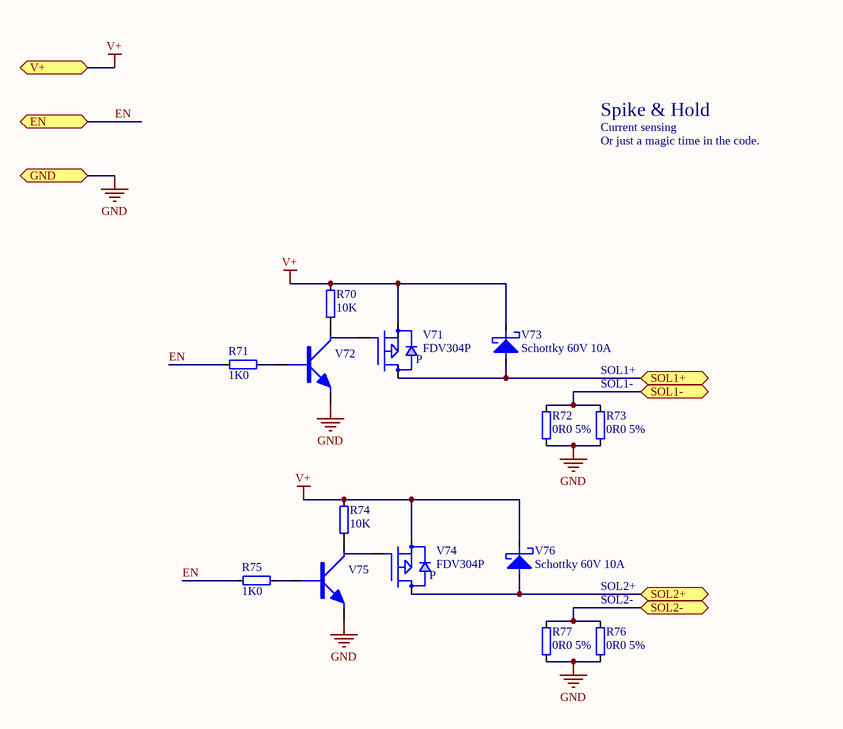
[diagram p8: 7_Solenoid.SchDoc]

### Parts
R70  10K  [1206]
R71  1K0  [0805]
R72  0R0 5%  [1206]
R73  0R0 5%  [1206]
R74  10K  [1206]
R75  1K0  [0805]
R76  0R0 5%  [1206]
R77  0R0 5%  [1206]
V71  FDV304P  [SOT23]
V72  BC846B  [SOT23]  (value not drawn)
V73  Schottky 60V 10A  [DO-214AB-DIODE]
V74  FDV304P  [SOT23]
V75  BC846B  [SOT23]  (value not drawn)
V76  Schottky 60V 10A  [DO-214AB-DIODE]

### Ports
EN, GND, SOL1+, SOL1-, SOL2+, SOL2-, V+

### Nets
GND: R72.1 R73.1 R76.1 R77.1 V72.y(Emitter) V75.y(Emitter) ; port GND
V+: R70.2 R74.2 V71.y(s) V73.k V74.y(s) V76.k ; port V+
EN: R71.1 R75.1 ; port EN
NetR70_1: R70.1 V72.x(Collector)
NetR71_2: R71.2 V72.z(Base)
NetR72_2: R72.2 R73.2 ; port SOL1-
NetR74_1: R74.1 V75.x(Collector)
NetR75_2: R75.2 V75.z(Base)
NetR76_2: R76.2 R77.2 ; port SOL2-
NetV71_x: V71.x(d) V73.a ; port SOL1+
NetV74_x: V74.x(d) V76.a ; port SOL2+

Not connected (* = marked no-connect by the designer): V71 z(gate); V74 z(gate)

### Notes on the sheet
- Spike & Hold
- Current sensing
- Or just a magic time in the code.
- (near R73) SOL1+
- (near R73) SOL1-
- (near R76) SOL2+
- (near R76) SOL2-
- (in symbol 5221) P

### Library data of the parts
R70 R74 = 3867: as R4 on sheet 11_Watchdog; Part Field 2: Phycomp RC1206FR-0710KL; ComponentLink1Description: Phycomp_RC1206series_DS.pdf; ComponentLink2Description: Phycomp_Generic_RCS.pdf; ComponentLink1URL: http://ecad.vsl.com.au/apps/BomGen/Data/rel/datasheets/new_parts/Phycomp_RC1206series_DS.pdf; ComponentLink2URL: http://ecad.vsl.com.au/apps/BomGen/Data/rel/rohs_compliance/new_certificates/Phycomp_Generic_RCS.pdf; Altium_Comment_Old: RES 10K 1% 250mW 1206 RoHS; Altium_Comment: 10K; Symbol: RES; Supplier1: Arrow; Supplier1_PartNumber: RC1206FR-0710KL; Supplier2: Xon; IPN_Search: 3867; PartType: PCB; CheckedBy: ART; Price_5000: M$0.004
R71 R75 = 3674: Resistor; Part Field 1: RES 1K0 1% 125mW 0805 RoHS; Manufacturer: Phycomp; PartNumber: RC0805FR-071KL; IPN: 3674; EndOfLife: Active EOL:Jan 2023; Characteristics: 100ppm/C -55..+155C U=150Vrms Reel=5000pcs; OrderNumber: 232273461002L; Lead_Process_Compatible: Yes; SubmittedBy: ART; DeviceRank: 2; Part Field 2: Phycomp RC0805FR-071KL; ComponentLink1Description: Phycomp_RC0805series_DS.pdf; ComponentLink2Description: Phycomp_Generic_RCS.pdf; ComponentLink1URL: http://ecad.vsl.com.au/apps/BomGen/Data/rel/datasheets/new_parts/Phycomp_RC0805series_DS.pdf; ComponentLink2URL: http://ecad.vsl.com.au/apps/BomGen/Data/rel/rohs_compliance/new_certificates/Phycomp_Generic_RCS.pdf; Altium_Comment_Old: RES 1K0 1% 125mW 0805 RoHS; Altium_Comment: 1K0; Symbol: RES; Supplier1: Arrow; Supplier1_PartNumber: RC0805FR-071KL; Supplier2: Xon; IPN_Search: 3674; PartType: PCB; CheckedBy: ART; Price_5000: M$0.003
R72 R73 R76 R77 = 3393: Resistor; Part Field 1: RES 0R0 5% 250mW LINK 1206 RoHS; Manufacturer: Phycomp; PartNumber: RC1206JR-070RL; IPN: 3393; EndOfLife: Active EOL:Jan 2031; Characteristics: 100ppm/C -55..+155C 2A 150Vrms Reel=5000pcs; OrderNumber: 232271191032L; Lead_Process_Compatible: Yes; SubmittedBy: ART; DeviceRank: 2; Part Field 2: Phycomp RC1206JR-070RL; ComponentLink1Description: Phycomp_RC1206series_DS.pdf; ComponentLink2Description: Phycomp_Generic_RCS.pdf; ComponentLink1URL: http://ecad.vsl.com.au/apps/BomGen/Data/rel/datasheets/new_parts/Phycomp_RC1206series_DS.pdf; ComponentLink2URL: http://ecad.vsl.com.au/apps/BomGen/Data/rel/rohs_compliance/new_certificates/Phycomp_Generic_RCS.pdf; Altium_Comment_Old: RES 0R0 5% 250mW LINK 1206 RoHS; Altium_Comment: 0R0 5%; Symbol: RES; Supplier1: Arrow; Supplier1_PartNumber: RC1206JR-070RL; Supplier2: Xon; IPN_Search: 3393; PartType: PCB; CheckedBy: ART; Price_5000: M$0.003
V71 V74 = 5221: as V20 on sheet 2_Safety_Relay; Part Field 2: Fairchild FDV304P; ComponentLink1Description: Fairchild_FDV304P_DS.pdf; ComponentLink2Description: Fairchild_Generic_RCS.pdf; ComponentLink1URL: http://ecad.vsl.com.au/apps/BomGen/Data/rel/datasheets/new_parts/Fairchild_FDV304P_DS.pdf; ComponentLink2URL: http://ecad.vsl.com.au/apps/BomGen/Data/rel/rohs_compliance/new_certificates/Fairchild_Generic_RCS.pdf; Altium_Comment_Old: MOSFET P-CH FDV304P SOT23; Altium_Comment: FDV304P; Symbol: MOSFET-P-SOT23; PartNumber: FDV304P; LastChanged: 10/06/10 13:58:43; Supplier1: Digikey; Supplier1_PartNumber: FDV304PCT-ND; Supplier2: Farnell; Supplier2_PartNumber: 9846123; IPN_Search: 5221; OrderNumber: FDV304P; PartType: PCB; Price: 0.697; CheckedBy: AJR; Price_100: M$0.102; Price_1000: M$0.070; Price_5000: M$0.053
V72 V75 = 3412: as V6 on sheet 11_Watchdog; Part Field 2: NXP BC846B; ComponentLink1Description: NXP_BC84xseries_DS.pdf; ComponentLink2Description: NXP_BC846B_MD.xls; ComponentLink1URL: http://ecad.vsl.com.au/apps/BomGen/Data/rel/datasheets/new_parts/NXP_BC84xseries_DS.pdf; ComponentLink2URL: Not Found; Altium_Comment_Old: BJT NPN BC846 SOT23 RoHS; Altium_Comment: BC846B; Symbol: NPN-SOT23; PartNumber: BC846B; LastChanged: 24/08/09 11:56:43; Supplier1: Mouser; Supplier1_PartNumber: 771-BC846B-T/R; Supplier2: Digikey; Supplier2_PartNumber: 568-1632-1-ND; IPN_Search: 3412; PartType: PCB; CheckedBy: LZZ; Price_100: M$0.040; Price_1000: M$0.027; Price_5000: M$0.020
V73 V76 = 9925: DIODE SCHOTTKY GENERIC; Part Field 1: DIODE SCHOTTKY 60V 10A SMD RoHS; Manufacturer: Micro Commercial Co; PartNumber: SK106-TP; IPN: 9925; Characteristics: Vrmax=60V Ifmax=10A Vf=0.85V -55..+125; Lead_Process_Compatible: Yes; SubmittedBy: zmze; DeviceRank: 2; Part Field 2: Micro Commercial Co SK106-TP; ComponentLink1Description: Micro Commercial Co_SK106-TP_SK102-SK1010(HSMC).PDF; ComponentLink2Description: Compliant; ComponentLink1URL: http://ecad.vsl.com.au/apps/BomGen/Data/rel/datasheets/Micro Commercial Co/Micro Commercial Co_SK106-TP_SK102-SK1010(HSMC).PDF; Altium_Comment_Old: DIODE SCHOTTKY 60V 10A SMD RoHS; Altium_Comment: Schottky 60V 10A; Symbol: SCHOTTKY; LastChanged: 26/08/16 14:34:18; Supplier1: Digikey; Supplier1_PartNumber: SK106-TPCT-ND; IPN_Search: 9925; OrderNumber: SK106-TP; PartType: PCB